# EasyEDA schematic SCH_n2_power_distribution_board_2022-03-29.json

## Sheets
1 PDB: TITLE: PDB_v4; REV: 1.0; Date: 2022-03-21; Sheet: 1/1; Drawn By: cmucheru; Company: Nakuja project
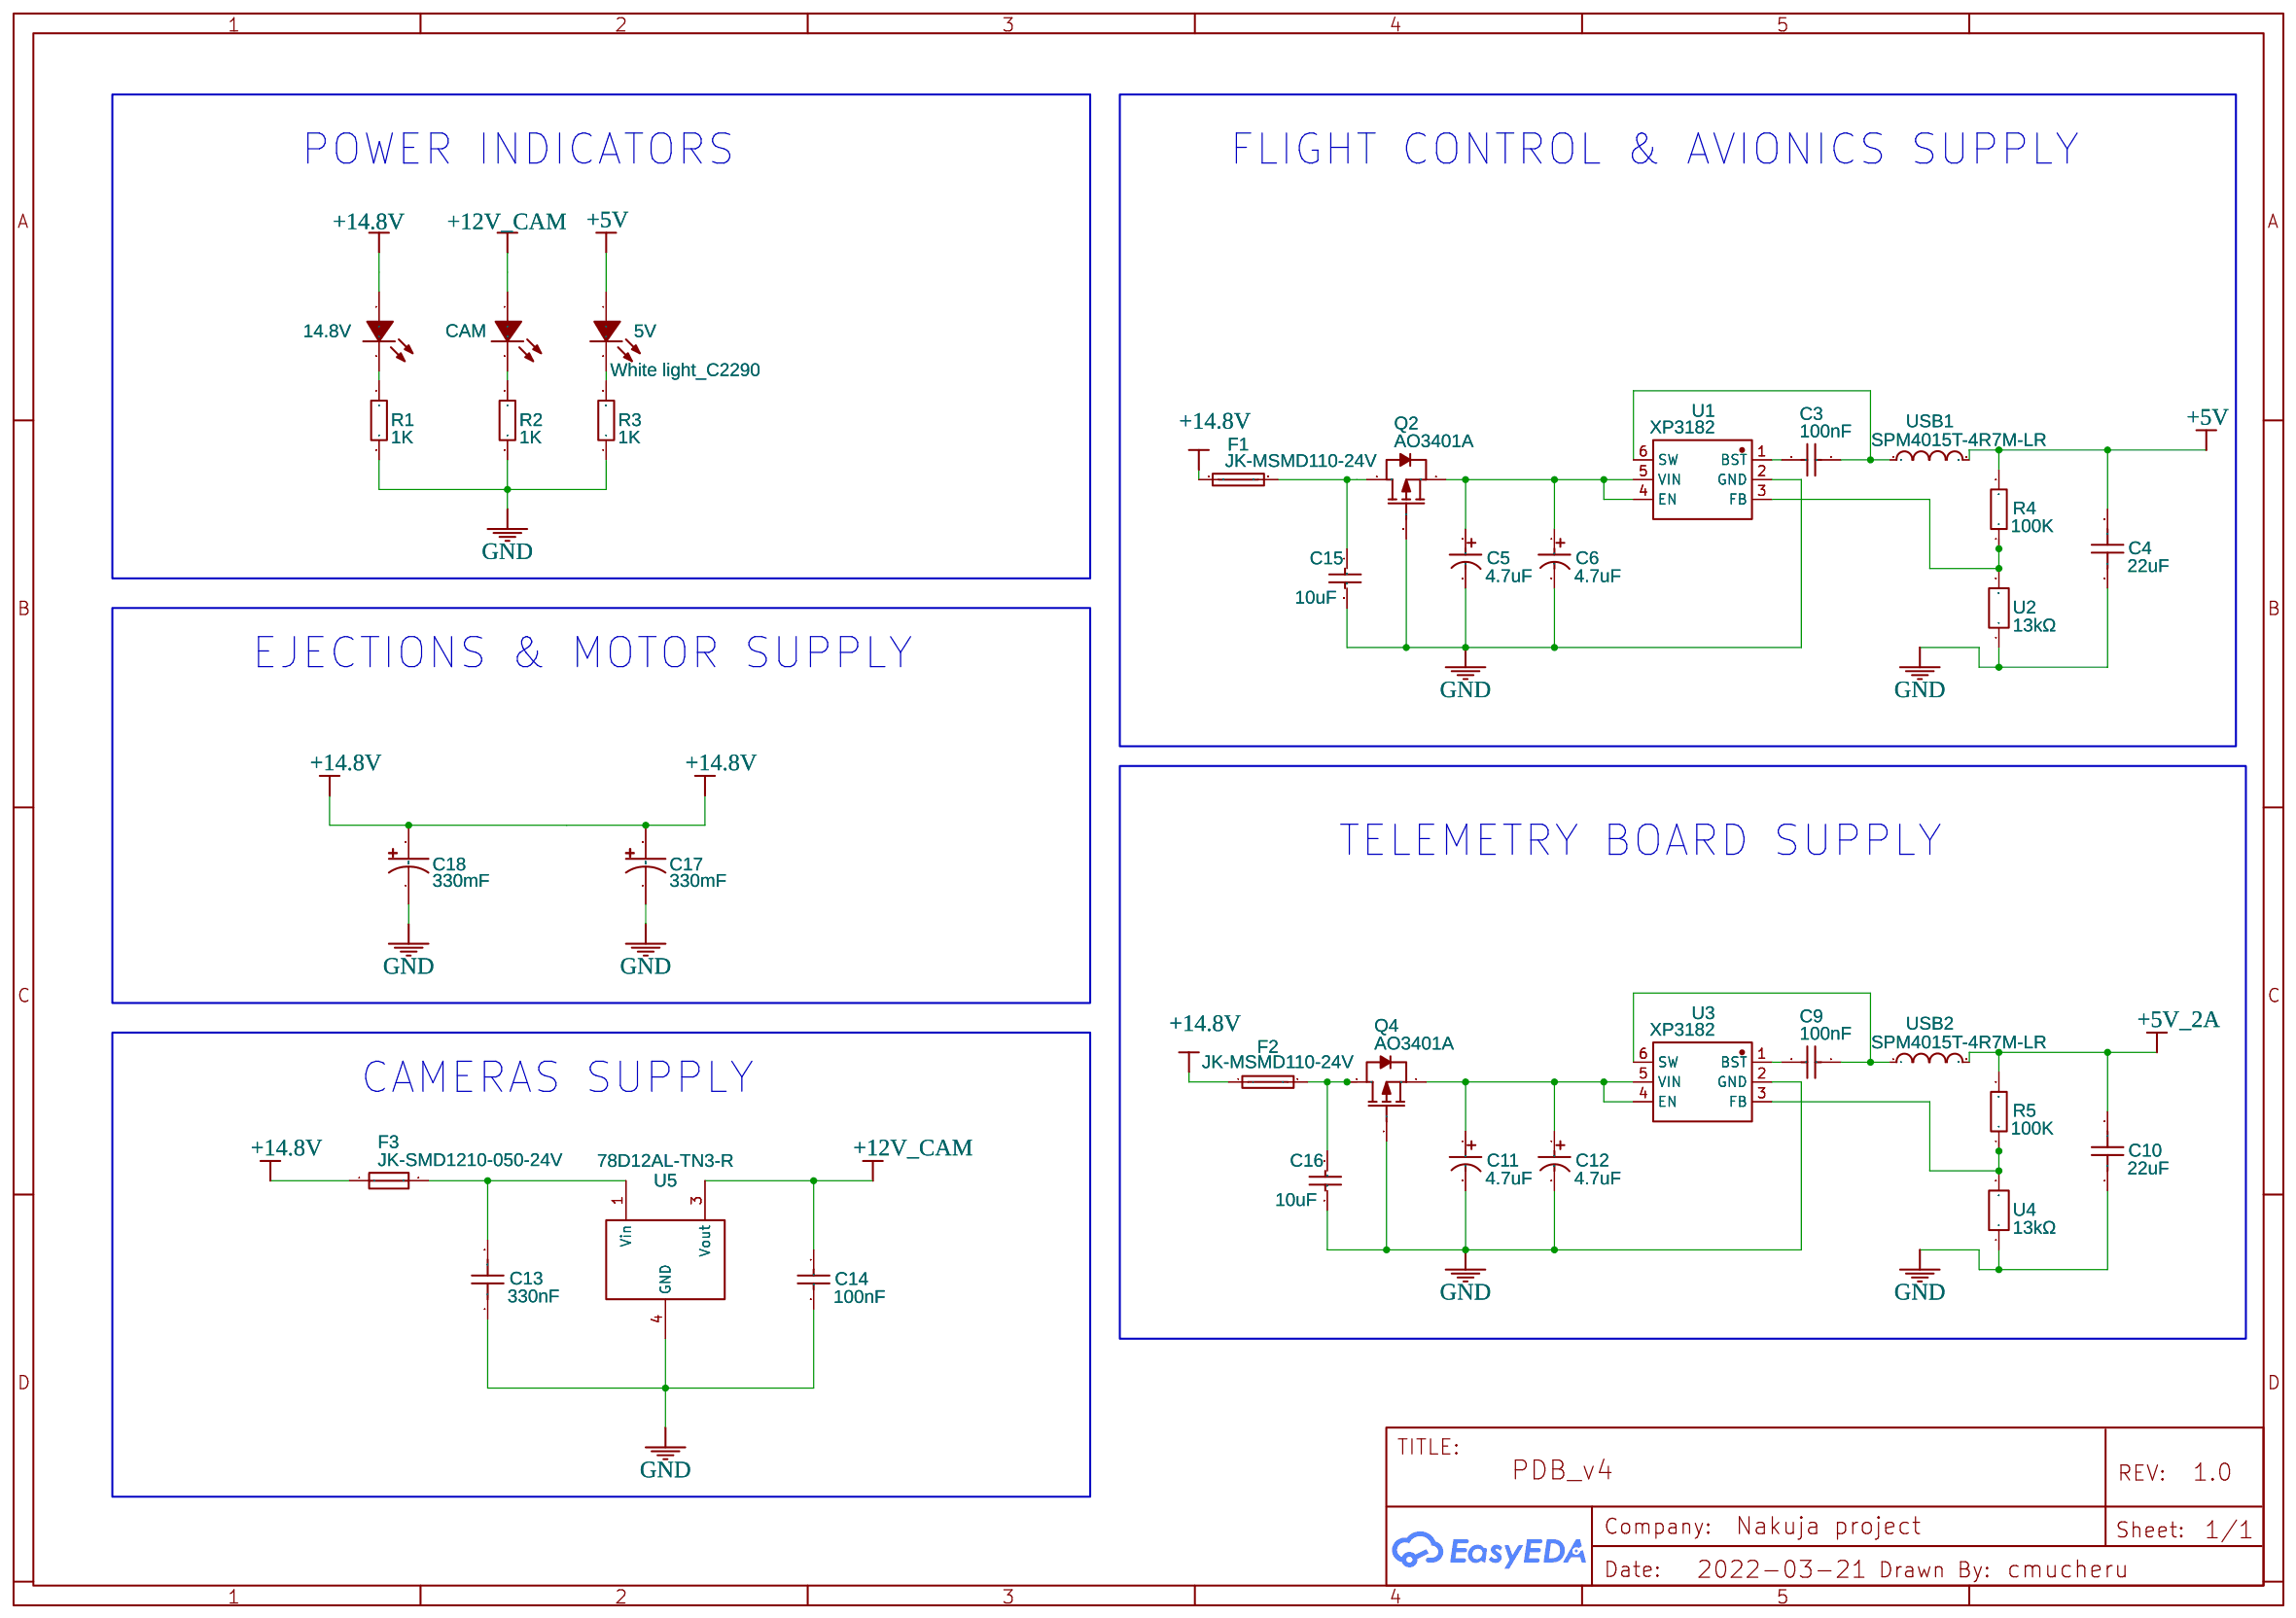
[diagram p0: PDB]
2 Connectors: TITLE: Sheet_1; Date: 2022-03-24; Drawn By: Rodney Osodo; Company: Your Company
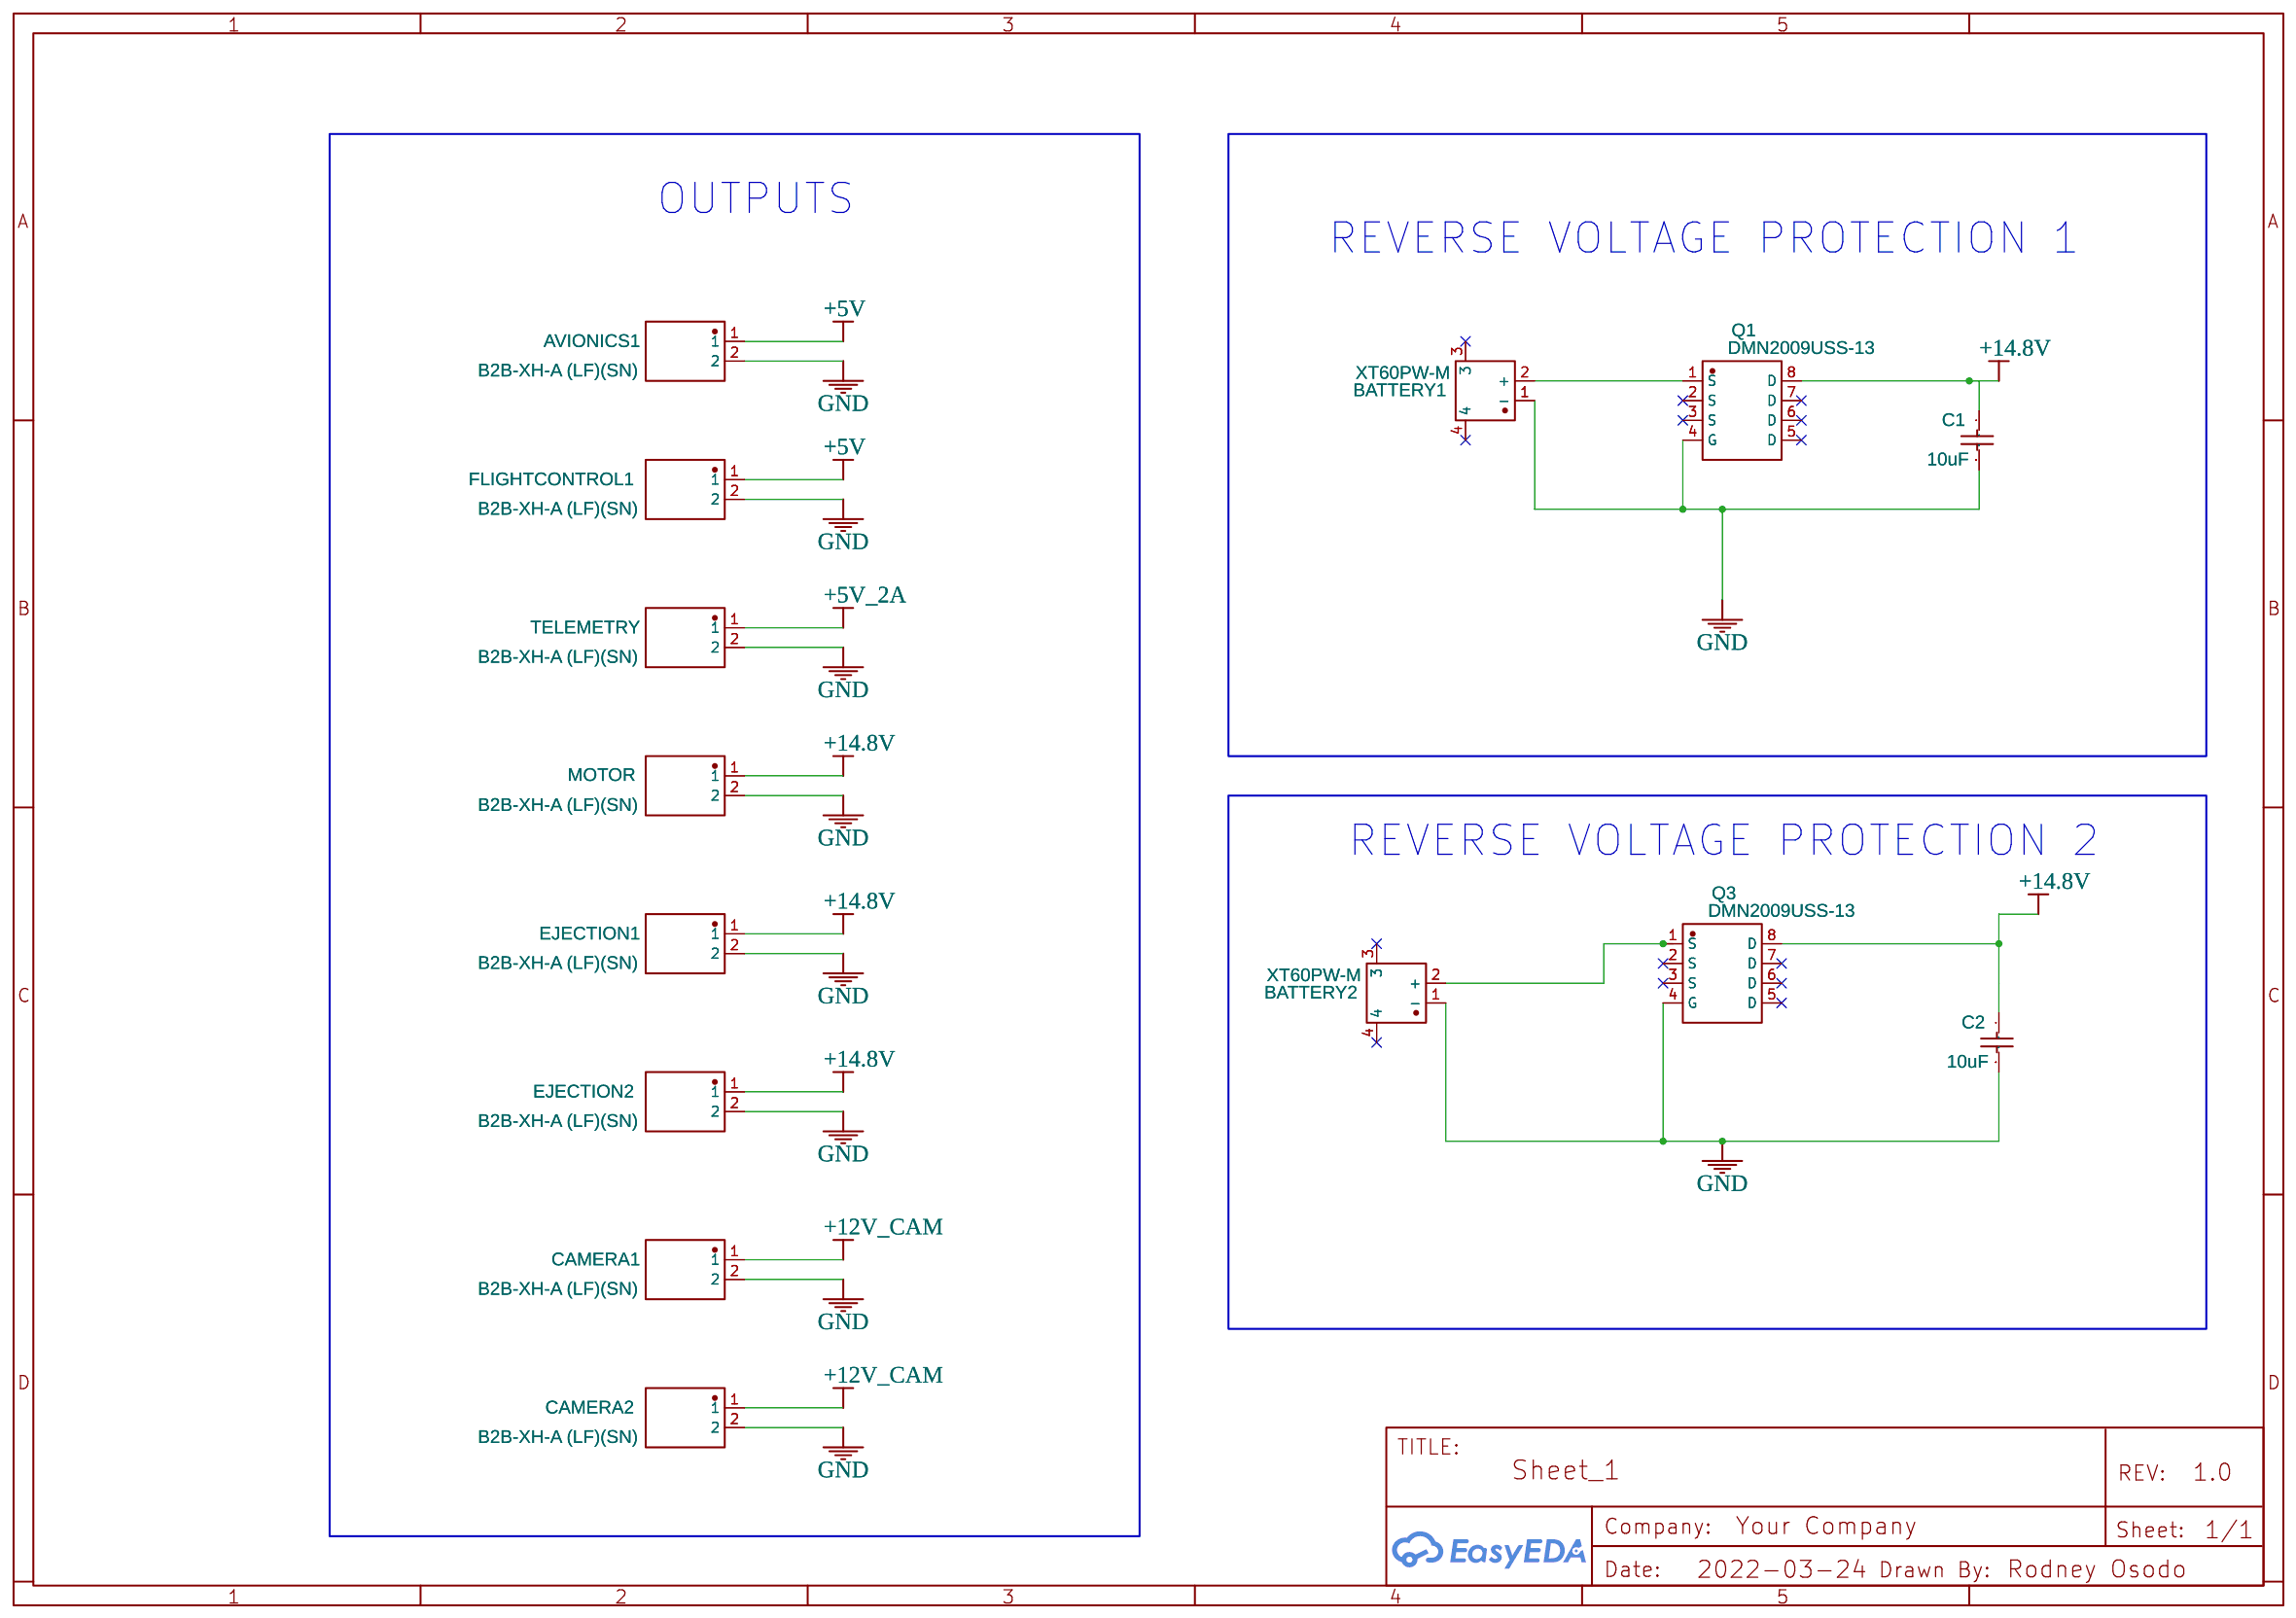
[diagram p1: Connectors]

## Parts
sheet Connectors
AVIONICS1  B2B-XH-A (LF)(SN)  [CONN-TH_B2B-XH-A-LF-SN]
BATTERY1  XT60PW-M  [CONN-TH_XT60PW-M]
BATTERY2  XT60PW-M  [CONN-TH_XT60PW-M]
C1  10uF  [C0402]
C2  10uF  [C0402]
CAMERA1  B2B-XH-A (LF)(SN)  [CONN-TH_B2B-XH-A-LF-SN]
CAMERA2  B2B-XH-A (LF)(SN)  [CONN-TH_B2B-XH-A-LF-SN]
EJECTION1  B2B-XH-A (LF)(SN)  [CONN-TH_B2B-XH-A-LF-SN]
EJECTION2  B2B-XH-A (LF)(SN)  [CONN-TH_B2B-XH-A-LF-SN]
FLIGHTCONTROL1  B2B-XH-A (LF)(SN)  [CONN-TH_B2B-XH-A-LF-SN]
MOTOR  B2B-XH-A (LF)(SN)  [CONN-TH_B2B-XH-A-LF-SN]
Q1  DMN2009USS-13  [SO-8_L4.9-W3.9-P1.27-LS5.9-BL]
Q3  DMN2009USS-13  [SO-8_L4.9-W3.9-P1.27-LS5.9-BL]
TELEMETRY  B2B-XH-A (LF)(SN)  [CONN-TH_B2B-XH-A-LF-SN]
sheet PDB
5V  White light_C2290  [LED0603-R-RD_WHITE]
14.8V  White light_C2290  [LED0603-R-RD_WHITE]
C3  100nF  [C0402_NEW]
C4  22uF  [C0402]
C5  4.7uF  [CAP-SMD_BD4.0-L4.3-W4.3-LS5.3-FD]
C6  4.7uF  [CAP-SMD_BD4.0-L4.3-W4.3-LS5.3-FD]
C9  100nF  [C0402_NEW]
C10  22uF  [C0402]
C11  4.7uF  [CAP-SMD_BD4.0-L4.3-W4.3-LS5.3-FD]
C12  4.7uF  [CAP-SMD_BD4.0-L4.3-W4.3-LS5.3-FD]
C13  330nF  [C0402]
C14  100nF  [C0402_NEW]
C15  10uF  [C0402]
C16  10uF  [C0402]
C17  330mF  [CAP-TH_BD10.5-P10.00-D1.2-FD]
C18  330mF  [CAP-TH_BD10.5-P10.00-D1.2-FD]
CAM  White light_C2290  [LED0603-R-RD_WHITE]
F1  JK-MSMD110-24V  [F1812]
F2  JK-MSMD110-24V  [F1812]
F3  JK-SMD1210-050-24V  [F1210]
Q2  AO3401A  [SOT-23_L2.9-W1.3-P1.90-LS2.4-BR]
Q4  AO3401A  [SOT-23_L2.9-W1.3-P1.90-LS2.4-BR]
R1  1K  [R0402]
R2  1K  [R0402]
R3  1K  [R0402]
R4  100K  [R0402]
R5  100K  [R0402]
U1  XP3182  [SOT-23-6_L2.9-W1.6-P0.95-LS2.8-BL]
U2  13kΩ  [R0402]
U3  XP3182  [SOT-23-6_L2.9-W1.6-P0.95-LS2.8-BL]
U4  13kΩ  [R0402]
U5  78D12AL-TN3-R  [TO-252-2_L6.5-W6.1-P4.58-LS10.0-TL]
USB1  SPM4015T-4R7M-LR  [IND-SMD_L4.4-W4.1]
USB2  SPM4015T-4R7M-LR  [IND-SMD_L4.4-W4.1]

## Library data of the parts
AVIONICS1 CAMERA1 CAMERA2 EJECTION1 EJECTION2 FLIGHTCONTROL1 MOTOR TELEMETRY = B2B-XH-A (LF)(SN): Supplier: LCSC; Supplier Part: C158012; Manufacturer: JST Sales America; Contributor: LCSC; JLCPCB Part Class: Extended Part
BATTERY1 BATTERY2 = XT60PW-M: Supplier: LCSC; Supplier Part: C98732; Manufacturer: AMASS(艾迈斯); JLCPCB Part Class: Extended Part; Contributor: LCSC
C1 C2 C15 C16 = CL05A106MQ5NUNC: Supplier: LCSC; Manufacturer: SAMSUNG; Supplier Part: C15525; SMT Type: Basic; JLCPCB SMD: Yes; LCSC Assembly: Yes; Paste Type: base
Q1 Q3 = DMN2009USS-13: Supplier: LCSC; Supplier Part: C460995; Manufacturer: Diodes Incorporated; Contributor: LCSC; JLCPCB Part Class: Extended Part
5V 14.8V CAM = 0603White light_C2290: Supplier: LCSC; Manufacturer: KENTO; Manufacturer Part: 0603White light; Supplier Part: C2290; JLCPCB Part Class: Basic Part
C3 C9 C14 = CL05B104KO5NNNC: Supplier: LCSC; Manufacturer: SAMSUNG; Supplier Part: C1525; JLCPCB Part Class: Basic Part
C4 C10 = GRM155R60J226ME11D: Supplier: LCSC; Supplier Part: C415703; Manufacturer: Murata Electronics; Contributor: LCSC; JLCPCB Part Class: Extended Part
C5 C6 C11 C12 = RVT1V4R7M0405: Supplier: LCSC; Manufacturer: ROQANG; Supplier Part: C72511; JLCPCB Part Class: Extended Part
C13 = CC0402ZRY5V7BB334: Supplier: LCSC; Supplier Part: C527033; Manufacturer: YAGEO(国巨); JLCPCB Part Class: Extended Part; Contributor: LCSC
C17 C18 = EECS0HD334H: Supplier: LCSC; Manufacturer: PANASONIC; Contributor: LCSC; Supplier Part: C128528
F1 F2 = JK-MSMD110-24V: Supplier: LCSC; Supplier Part: C369172; Manufacturer: Jinrui Electronic Materials Co.; Contributor: LCSC; JLCPCB Part Class: Extended Part
F3 = JK-SMD1210-050-24V: Supplier: LCSC; Supplier Part: C720078; Manufacturer: Jinrui Electronic Materials Co.; Contributor: LCSC; JLCPCB Part Class: Extended Part
Q2 Q4 = AO3401A: Supplier: LCSC; Manufacturer: AOS; Supplier Part: C15127; JLCPCB Part Class: Basic Part
R1-R3 = 0402WGF5101TCE: Supplier: LCSC; Manufacturer: UniOhm; Supplier Part: C25905; JLCPCB Part Class: Basic Part
R4 R5 = 0402WGF1003TCE: Supplier: LCSC; Manufacturer: UniOhm; Supplier Part: C25741; JLCPCB Part Class: Basic Part
U1 U3 = XP3182: Supplier: LCSC; Supplier Part: C2802261; Manufacturer: FM富满; Contributor: LCSC; JLCPCB Part Class: Extended Part
U2 U4 = PTFR0402B13K0P9: Supplier: LCSC; Supplier Part: C2693072; Manufacturer: RESI(开步睿思）; Contributor: LCSC; JLCPCB Part Class: Extended Part
U5 = 78D12AL-TN3-R: Supplier: LCSC; Manufacturer: UTC; Supplier Part: C73290; JLCPCB Part Class: Extended Part
USB1 USB2 = SPM4015T-4R7M-LR: Supplier: LCSC; Supplier Part: C2052599; Manufacturer: TDK; JLCPCB Part Class: Extended Part; Contributor: LCSC; Inductance: 4.7uH

## Nets
+5V: 5V.1(A) AVIONICS1.1 C4.2 FLIGHTCONTROL1.1 R4.2 USB1.2
+5V_2A: C10.2 R5.2 TELEMETRY.1 USB2.2
+12V_CAM: C14.1 CAM.1(A) CAMERA1.1 CAMERA2.1 U5.3(Vout)
+14.8V: 14.8V.1(A) C1.1 C2.1 C17.1 C18.1 EJECTION1.1 EJECTION2.1 F1.1 F2.1 F3.1 MOTOR.1 Q1.8(D) Q3.8(D)
GND: AVIONICS1.2 BATTERY1.1(-) BATTERY2.1(-) C1.2 C2.2 C4.1 C5.2 C6.2 C10.1 C11.2 C12.2 C13.1 C14.2 C15.2 C16.2 C17.2 C18.2 CAMERA1.2 CAMERA2.2 EJECTION1.2 EJECTION2.2 FLIGHTCONTROL1.2 MOTOR.2 Q1.4(G) Q2.1(G) Q3.4(G) Q4.1(G) R1.2 R2.2 R3.1 TELEMETRY.2 U1.2(GND) U2.1 U3.2(GND) U4.1 U5.4(GND)
Net-(5V-2): 5V.2(K) R3.2
Net-(14.8V-2): 14.8V.2(K) R1.1
Net-(BATTERY1-2): BATTERY1.2(+) Q1.1(S)
Net-(BATTERY2-2): BATTERY2.2(+) Q3.1(S)
Net-(C3-1): C3.1 U1.6(SW) USB1.1
Net-(C3-2): C3.2 U1.1(BST)
Net-(C5-1): C5.1 C6.1 Q2.2(S) U1.4(EN) U1.5(VIN)
Net-(C9-1): C9.1 U3.6(SW) USB2.1
Net-(C9-2): C9.2 U3.1(BST)
Net-(C11-1): C11.1 C12.1 Q4.2(S) U3.4(EN) U3.5(VIN)
Net-(C13-2): C13.2 F3.2 U5.1(Vin)
Net-(C15-1): C15.1 F1.2 Q2.3(D)
Net-(C16-1): C16.1 F2.2 Q4.3(D)
Net-(CAM-2): CAM.2(K) R2.1
Net-(R4-1): R4.1 U1.3(FB) U2.2
Net-(R5-1): R5.1 U3.3(FB) U4.2

Not connected (* = marked no-connect by the designer): BATTERY1 3* 4*; BATTERY2 3* 4*; Q1 2(S)* 3(S)* 5(D)* 6(D)* 7(D)*; Q3 2(S)* 3(S)* 5(D)* 6(D)* 7(D)*

## Notes on the sheets
sheet 1
- POWER INDICATORS
- FLIGHT CONTROL & AVIONICS SUPPLY
- EJECTIONS & MOTOR SUPPLY
- TELEMETRY BOARD SUPPLY
- CAMERAS SUPPLY
sheet 2
- OUTPUTS
- REVERSE VOLTAGE PROTECTION 1
- REVERSE VOLTAGE PROTECTION 2
